# Altium schematic sheet [26] - BLE, WIFI.SchDoc (part 2 of 2)
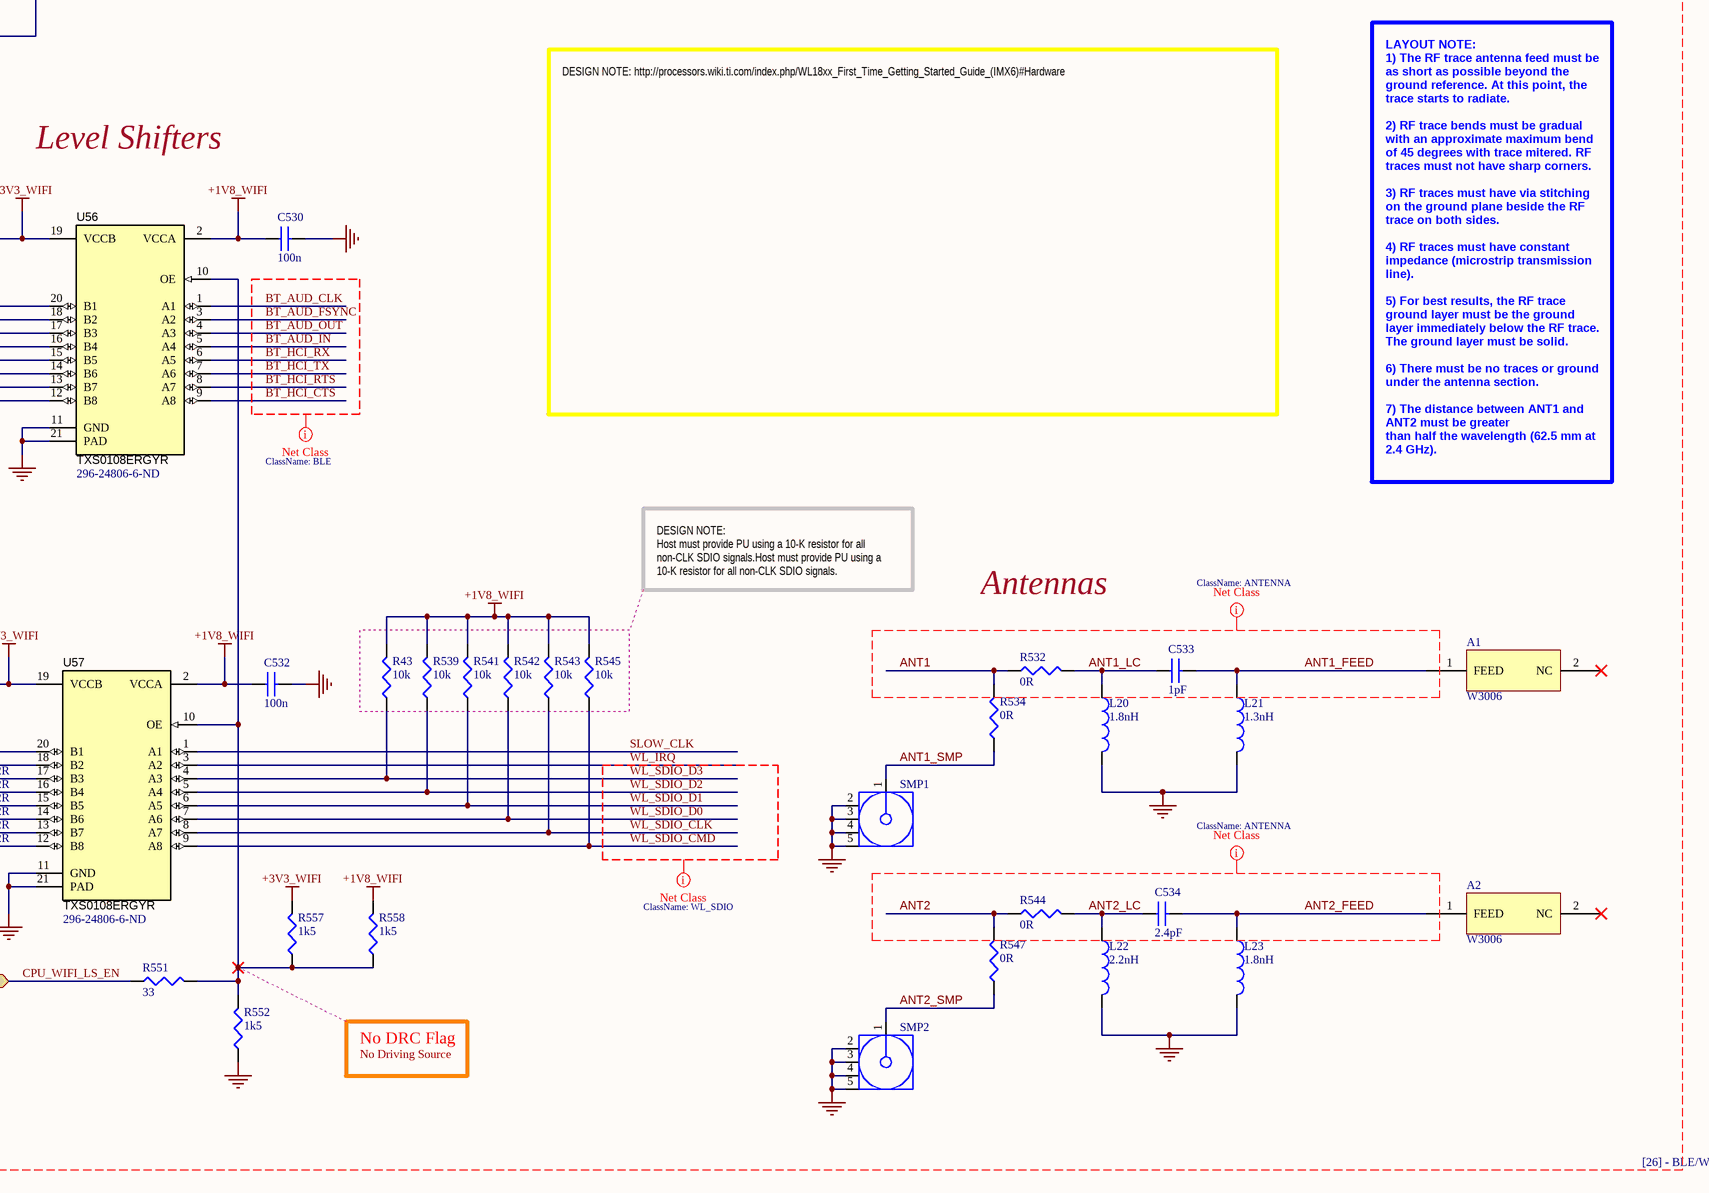
[diagram p4: [26] - BLE, WIFI.SchDoc, bottom right]

## Library data of the parts
A1 A2 = W3006: ANTENNA WLAN DUALBAND CERAM CHIP; Manufacturer: Pulse Electronics; Impedance: 50R; Frequency: 5GHz; Number of Bands: 2; Return Loss: -10dB; Max Frequency: 5.85GHz; .Creator: MB; Supplier 1: Digi-Key; Manufacturer Part Number: W3006; Stock 1: 500; Pricing 1: 1=2.04, 10=1.846, 25=1.648, 100=1.4832, 250=1.3184, 500=1.1536 (USD); Mount: Surface Mount; Case/Package: SMD/SMT; Number of Pins: 2; Contact Plating: Tin,Matte; Min Operating Temperature: -40°C; Max Operating Temperature: 85°C; Termination: Solder; Packaging: Bulk; Package Quantity: 1; Length: 10mm; Height: 0.059inch; Width: 3.2mm; Radiation Hardening: No; ComponentLink1URL: https://datasheet.ciiva.com/2792/+w3006-2792242.pdf; ComponentLink1Description: https://datasheet.ciiva.com/2792/+w3006-2792242.pdf; ComponentLink2URL: https://datasheet.ciiva.com/2792/+w3006-2792243.pdf; ComponentLink2Description: https://datasheet.ciiva.com/2792/+w3006-2792243.pdf; ComponentLink3URL: https://datasheet.ciiva.com/2792/+w3006-2792244.pdf; ComponentLink3Description: https://datasheet.ciiva.com/2792/+w3006-2792244.pdf; ComponentLink4URL: https://datasheet.ciiva.com/4432/w3006-203400-4432372.pdf; ComponentLink4Description: https://datasheet.ciiva.com/4432/w3006-203400-4432372.pdf; ComponentLink5URL: https://datasheet.ciiva.com/8152/antennas-g00302-8152982.pdf; ComponentLink5Description: https://datasheet.ciiva.com/8152/antennas-g00302-8152982.pdf; Supplier Part Number 1: 553-1673-1-ND; .Checked SCH: *; .Checked PCB: *
C522 = C0603X5R1C104K030BC: CAP CER 0.1UF 16V 10% X5R 0201; Manufacturer: TDK Corporation; Capacitance: 0.1µF; .Creator: MM; .Checked PCB: used; Supplier 1: Digi-Key; Manufacturer Part Number: C0603X5R1C104K030BC; RoHS: RoHS Compliant; Category: Capacitors; Stock 1: 19491; Pricing 1: 1=0.1, 10=0.046, 100=0.0209, 250=0.01712, 500=0.01464, 1000=0.0114, 5000=0.0095 (USD); Packaging: Cut Tape (CT); Tolerance: ±10%; Voltage - Rated: 16V; Temperature Coefficient: X5R; Mounting Type: Surface Mount, MLCC; Operating Temperature: -55°C ~ 85°C; Applications: General Purpose; Ratings: -; Package / Case: 0201 (0603 Metric); Size / Dimension: 0.024" L x 0.012" W (0.60mm x 0.30mm); Height - Seated (Max): -; Thickness (Max): 0.013" (0.33mm); Lead Spacing: -; Features: -; Lead Style: -; ComponentLink1URL: http://product.tdk.com/en/catalog/datasheets/mlcc_commercial_general_en.pdf; ComponentLink1Description: http://product.tdk.com/en/catalog/datasheets/mlcc_commercial_general_en.pdf; Supplier Part Number 1: 445-7313-1-ND; .Checked SCH: used; Supplier 2: Digi-Key
C523-C525 = C1608X5R0J106M: CAP CER 10UF 6.3V X5R 20% 0603; Manufacturer: TDK Corporation; Capacitance: 10µF; Value: 10µF; .Checked PCB: used; Category: Capacitors; Supplier Part Number: 445-4112-1-ND; Manufacturer Part Number: C1608X5R0J106M; Operating Temperature: -55°C ~ 85°C; Package / Case: 0603 (1608 Metric); Price 1k [$]: 0.08580; .Checked SCH: used; Voltage - Rated: 6.3V; Features: Low ESR; Supplier: Digikey; Supplier 1: Digi-Key; Supplier Part Number 1: 445-4112-1-ND; RoHS: RoHS Compliant; Stock 1: 48157; Pricing 1: 1=0.46, 10=0.363, 100=0.1898, 250=0.14024, 500=0.1089, 1000=0.0858 (USD); Tolerance: ±20%; Temperature Coefficient: X5R; Mounting Type: Surface Mount, MLCC; Applications: General Purpose; Ratings: -; Size / Dimension: 0.063" L x 0.031" W (1.60mm x 0.80mm); Height - Seated (Max): -; Thickness (Max): 0.037" (0.95mm); Lead Spacing: -; Packaging: Cut Tape (CT); Lead Style: -; ComponentLink1URL: http://www.tdk.com/pdf/general_B11.pdf; ComponentLink1Description: http://www.tdk.com/pdf/general_B11.pdf
C526 = GRM0335C1H6R8BA01D: CAP CER 6.8pF 0201 50volts C0G +/-0.1pF; Manufacturer: Murata; Voltage Rating: 50V; .Creator: MB; Supplier 1: Digi-Key; Manufacturer Part Number: GRM0335C1H6R8BA01D; Stock 1: 29500; Pricing 1: 1=0.1, 10=0.021, 100=0.0092, 500=0.00656, 1000=0.00516, 2500=0.00469, 5000=0.00431 (USD); Mount: Surface Mount; Case/Package: 0201; Case Code (Imperial): 0201; Case Code (Metric): 0603; Min Operating Temperature: -55°C; Max Operating Temperature: 125°C; Capacitance: 6.8pF; Voltage Rating (DC): 50V; Packaging: Tape and Reel; Package Quantity: 15000; Dielectric: C0G; Termination: SMD/SMT; Length: 0.024inch; Height: 0.3mm; Width: 0.3mm; Thickness: 0.013inch; ComponentLink1URL: https://datasheet.ciiva.com/29538/partnumbering-e-01-29538455.pdf; ComponentLink1Description: https://datasheet.ciiva.com/29538/partnumbering-e-01-29538455.pdf; Supplier Part Number 1: 490-17817-1-ND; .Checked SCH: *; .Checked PCB: *
C527 = C1005X5R1C105K: CAP CER 1.0UF 16V X5R 0402; Manufacturer: TDK Corporation; Capacitance: 1.0µF; Value: 1uF; .Checked PCB: used; Tolerance: ±10%; Category: Capacitors; Supplier Part Number: 445-4978-1-ND; Manufacturer Part Number: C1005X5R1C105K; Operating Temperature: -55°C ~ 85°C; Package / Case: 0402 (1005 Metric); Price 1k [$]: 0.02080; .Checked SCH: used; Voltage - Rated: 16V; Supplier: Digikey; Supplier 1: Digi-Key; Supplier Part Number 1: 445-4978-1-ND; RoHS: RoHS Compliant; Stock 1: 341010; Pricing 1: 1=0.24, 10=0.16, 100=0.064, 250=0.046, 500=0.0328, 1000=0.024 (USD); Temperature Coefficient: X5R; Mounting Type: Surface Mount, MLCC; Applications: General Purpose; Ratings: -; Size / Dimension: 0.039" L x 0.020" W (1.00mm x 0.50mm); Height - Seated (Max): -; Thickness (Max): 0.022" (0.55mm); Lead Spacing: -; Features: -; Packaging: Cut Tape (CT); Lead Style: -; ComponentLink1URL: http://www.tdk.co.jp/tefe02/e412_c.pdf; ComponentLink1Description: http://www.tdk.co.jp/tefe02/e412_c.pdf; Supplier 2: Digi-Key; Supplier Part Number 2: 445-13181-1-ND
C528-C532 = C1005X5R1H104K: CAP CER .10UF 50V X5R 10% 0402; Manufacturer: TDK Corporation; Capacitance: 0.1µF; Value: 100nF; .Checked PCB: used; Category: Capacitors; Supplier Part Number: 445-5942-1-ND; Manufacturer Part Number: C1005X5R1H104K; Operating Temperature: -55°C ~ 85°C; Package / Case: 0402 (1005 Metric); Price 1k [$]: 0.02340; .Checked SCH: used; Voltage - Rated: 50V; Supplier: Digikey; Supplier 1: Digi-Key; Supplier Part Number 1: 445-5942-1-ND; RoHS: RoHS Compliant; Stock 1: 106926; Pricing 1: 1=0.27, 10=0.18, 100=0.072, 250=0.05176, 500=0.0369, 1000=0.027 (USD); Tolerance: ±10%; Temperature Coefficient: X5R; Mounting Type: Surface Mount, MLCC; Applications: General Purpose; Ratings: -; Size / Dimension: 0.039" L x 0.020" W (1.00mm x 0.50mm); Height - Seated (Max): -; Thickness (Max): 0.022" (0.55mm); Lead Spacing: -; Features: -; Packaging: Cut Tape (CT); Lead Style: -; ComponentLink1URL: http://www.tdk.co.jp/tefe02/e412_c.pdf; ComponentLink1Description: http://www.tdk.co.jp/tefe02/e412_c.pdf; Supplier 2: Digi-Key; Supplier Part Number 2: 311-1697-6-ND
C533 = GJM1555C1H1R0BB01D: CAP CER 1pF 50V C0G 0.1pF SMD 0402 125C T/R; Manufacturer: Murata; Temperature Coefficient: 30ppm/°C; .Creator: MB; Supplier 1: Digi-Key; Manufacturer Part Number: GJM1555C1H1R0BB01D; Stock 1: 8519; Pricing 1: 1=0.17, 10=0.122, 100=0.0572, 500=0.04012, 1000=0.03322, 2500=0.03092, 5000=0.02829 (USD); Mount: Surface Mount; Case/Package: 0402; Number of Pins: 2; Case Code (Metric): 1005; Case Code (Imperial): 0402; Min Operating Temperature: -55°C; Max Operating Temperature: 125°C; Capacitance: 1pF; Dielectric: C0G; Voltage Rating: 50V; Packaging: Tape and Reel; Package Quantity: 10000; Termination: SMD/SMT; Voltage Rating (DC): 50V; Voltage: 50V; Length: 1mm; Height: 0.5mm; Width: 0.02inch; Thickness: 0.022inch; Depth: 0.5mm; Lead Pitch: 0.3mm; Radiation Hardening: No; Lead Free: Lead Free; REACH SVHC: No SVHC; ComponentLink1URL: https://datasheet.ciiva.com/2989/product-2989251.pdf; ComponentLink1Description: https://datasheet.ciiva.com/2989/product-2989251.pdf; ComponentLink2URL: https://datasheet.ciiva.com/8030/1700185-8030099.pdf; ComponentLink2Description: https://datasheet.ciiva.com/8030/1700185-8030099.pdf; ComponentLink3URL: https://datasheet.ciiva.com/6270/partnumbering-e-01-6270536.pdf; ComponentLink3Description: https://datasheet.ciiva.com/6270/partnumbering-e-01-6270536.pdf; ComponentLink4URL: https://datasheet.ciiva.com/18183/getdatasheetpartid-153061-18183816.pdf; ComponentLink4Description: https://datasheet.ciiva.com/18183/getdatasheetpartid-153061-18183816.pdf; ComponentLink5URL: https://datasheet.ciiva.com/6270/partnumbering-e-01-6270537.pdf; ComponentLink5Description: https://datasheet.ciiva.com/6270/partnumbering-e-01-6270537.pdf; ComponentLink6URL: https://datasheet.ciiva.com/6270/partnumbering-e-01-6270538.pdf; ComponentLink6Description: https://datasheet.ciiva.com/6270/partnumbering-e-01-6270538.pdf; ComponentLink7URL: https://datasheet.ciiva.com/11789/0900766b80ef921d-11789098.pdf; ComponentLink7Description: https://datasheet.ciiva.com/11789/0900766b80ef921d-11789098.pdf; Supplier Part Number 1: 490-6073-1-ND; .Checked SCH: *; .Checked PCB: *
C534 = GJM1555C1H2R4BB01D: CAP CER 2.4pF 0402 50Volts C0G +/-0.1pF; Manufacturer: Murata; Voltage Rating: 50V; .Creator: MB; Supplier 1: Digi-Key; Manufacturer Part Number: GJM1555C1H2R4BB01D; Stock 1: 81966; Pricing 1: 1=0.19, 10=0.13, 100=0.0659, 500=0.04508, 1000=0.03987, 2500=0.03814, 5000=0.03467 (USD); Mount: Surface Mount; Case/Package: 0402; Case Code (Metric): 1005; Case Code (Imperial): 0402; Min Operating Temperature: -55°C; Max Operating Temperature: 125°C; Capacitance: 2.4pF; Dielectric: C0G; Packaging: Tape and Reel; Package Quantity: 1; Voltage Rating (DC): 50V; Termination: SMD/SMT; Voltage: 50V; Length: 1mm; Height: 0.5mm; Width: 0.02inch; Thickness: 0.022inch; Depth: 0.5mm; Radiation Hardening: No; Lead Free: Lead Free; ComponentLink1URL: https://datasheet.ciiva.com/29541/partnumbering-e-01-29541979.pdf; ComponentLink1Description: https://datasheet.ciiva.com/29541/partnumbering-e-01-29541979.pdf; ComponentLink2URL: https://datasheet.ciiva.com/29541/partnumbering-e-01-29541980.pdf; ComponentLink2Description: https://datasheet.ciiva.com/29541/partnumbering-e-01-29541980.pdf; ComponentLink3URL: https://datasheet.ciiva.com/29541/partnumbering-e-01-29541981.pdf; ComponentLink3Description: https://datasheet.ciiva.com/29541/partnumbering-e-01-29541981.pdf; Supplier Part Number 1: 490-8093-1-ND; .Checked SCH: *; .Checked PCB: *
D54 = LG L29K-G2J1-24-Z: LED SMARTLED GREEN 570NM 0603; Manufacturer: OSRAM Opto Semiconductors Inc; .Checked PCB: used; Current - Test: 2mA; Voltage - Forward (Vf) Typ: 1.7V; Luminous Flux @ Current - Test: 12 mlm; Millicandela Rating: 3.92mcd; Wavelength - Peak: 572nm; Lens Type: Diffused; Lens Style/Size: Rectangle with Flat Top, 1.3mm x 0.8mm; Viewing Angle: 160°; Regulator Topology: Positive Fixed; Voltage - Output: 2.5V; Voltage - Input: 2.6 V ~ 6 V; Voltage - Dropout (Typical): 0.16V @ 500mA; Number of Regulators: 1; Current - Output: 500mA; Current - Limit (Min): 600mA; .Checked SCH: used; Category: Optoelectronics; Family: LEDs - <75mA, Discre; Manufacturer Part Number: LG L29K-G2J1-24-Z; Price 1k [$]: 0.08744; Value: Green; Color: Green; Package / Case: 0603 (1608 Metric); Supplier Part Number: 475-2709-1-ND; Supplier: Digikey; Supplier 1: Digi-Key; Supplier Part Number 1: 475-2709-1-ND; RoHS: RoHS Compliant; Stock 1: 30318; Pricing 1: 1=0.16, 10=0.137, 100=0.1093, 250=0.09564, 500=0.08744 (USD); Wavelength - Dominant: 570nm; Size / Dimension: 1.70mm L x 0.80mm W; Height: 0.65mm; Mounting Type: Surface Mount; Packaging: Cut Tape (CT); ComponentLink1URL: http://catalog.osram-os.com/catalogue/catalogue.do;jsessionid=32CB61882C089EDD4B6D0A54E7E1F117?act=downloadFile&favOid=020000020000138e000100b6; ComponentLink1Description: http://catalog.osram-os.com/catalogue/catalogue.do;jsessionid=32CB61882C089EDD4B6D0A54E7E1F117?act=downloadFile&favOid=020000020000138e000100b6; Operating Temperature: -40°C ~ 125°C; Supplier Device Package: 6-TMLF® (1.6x1.6); ComponentLink2URL: http://www.micrel.com/_PDF/mic5353.pdf; ComponentLink2Description: http://www.micrel.com/_PDF/mic5353.pdf
D55 = LO L29K-H2K1-24-Z: LED SMARTLED ORANGE 606NM 0603; Manufacturer: OSRAM Opto Semiconductors Inc; Millicandela Rating: 6.3mcd; Voltage - Forward (Vf) Typ: 1.8V; Current - Test: 2mA; Wavelength - Peak: 610nm; Viewing Angle: 160°; Lens Type: Diffused; Lens Style/Size: Rectangle with Flat Top, 1.3mm x 0.8mm; Luminous Flux @ Current - Test: 25 mlm; .Checked PCB: used; Supplier 1: Digi-Key; Supplier Part Number 1: 475-2740-1-ND; Manufacturer Part Number: LO L29K-H2K1-24-Z; RoHS: RoHS Compliant; Category: Optoelectronics; Stock 1: 15900; Pricing 1: 1=0.17, 10=0.141, 100=0.1127, 250=0.0986, 500=0.09016 (USD); Color: Orange; Wavelength - Dominant: 606nm; Package / Case: 0603 (1608 Metric); Size / Dimension: 1.70mm L x 0.80mm W; Height: 0.65mm; Mounting Type: Surface Mount; Packaging: Cut Tape (CT); ComponentLink1URL: http://catalog.osram-os.com/catalogue/catalogue.do;jsessionid=302CF83AF637AE24E40AEB0ADA267EDD?act=downloadFile&favOid=020000010003f9de000100b6; ComponentLink1Description: http://catalog.osram-os.com/catalogue/catalogue.do;jsessionid=302CF83AF637AE24E40AEB0ADA267EDD?act=downloadFile&favOid=020000010003f9de000100b6; .Checked SCH: used
FB50 FB51 = MPZ1608S601A: FERRITE CHIP BEAD 600 OHM SMD 1A; Manufacturer: TDK Corporation; Impedance @ Frequency: 600 Ohm @ 100MHz; DC Resistance (DCR): 150 mOhm Max; Filter Type: Differential Mode - Single; Number of Lines: 1; .Checked PCB: used; Supplier 1: Digi-Key; Supplier Part Number 1: 445-2205-1-ND; Manufacturer Part Number: MPZ1608S601A; RoHS: RoHS Compliant; Category: Filters; Stock 1: 328345; Pricing 1: 1=0.36, 10=0.24, 100=0.096, 250=0.069, 500=0.0492, 1000=0.036 (USD); Current Rating: 1A; Package / Case: 0603 (1608 Metric); Mounting Type: Surface Mount; Packaging: Cut Tape (CT); Height (Max): 0.037" (0.95mm); Size / Dimension: 0.063" L x 0.031" W (1.60mm x 0.80mm); ComponentLink1URL: http://www.tdk.co.jp/tefe02/e9413_mpz.pdf; ComponentLink1Description: http://www.tdk.co.jp/tefe02/e9413_mpz.pdf; .Checked SCH: used
FB52 = BLM15PD121SN1D: FERRITE CHIP 120 OHM 1300MA 0402; Manufacturer: Murata Electronics North America; Impedance @ Frequency: 120 Ohm @ 100MHz; DC Resistance (DCR): 90 mOhm Max; Filter Type: Differential Mode - Single; .Checked PCB: used; .Creator: MM; Supplier 1: Digi-Key; Manufacturer Part Number: BLM15PD121SN1D; RoHS: RoHS Compliant; Category: Filters; Stock 1: 478960; Pricing 1: 1=0.12, 10=0.096, 50=0.0636, 100=0.0549, 250=0.04332, 500=0.03658, 1000=0.0308, 5000=0.02743 (USD); Packaging: Cut Tape (CT); Current Rating: 1.3A; Package / Case: 0402 (1005 Metric); Mounting Type: Surface Mount; Height (Max): 0.022" (0.55mm); Size / Dimension: 0.039" L x 0.020" W (1.00mm x 0.50mm); ComponentLink1URL: http://media.digikey.com/pdf/Data%20Sheets/Murata%20PDFs/BLM15P_Series.pdf; ComponentLink1Description: http://media.digikey.com/pdf/Data%20Sheets/Murata%20PDFs/BLM15P_Series.pdf; Supplier Part Number 1: 490-5203-1-ND; .Checked SCH: used
L19 = IHLP1616ABER2R2M11: FIXED IND 2.2UH 2.75A 83.5 MOHM; Manufacturer: Vishay Dale; Type: Molded; Inductance: 2.2µH; Tolerance: ±20%; Current - Saturation: 3A; Shielding: Shielded; DC Resistance (DCR): 83.5 mOhm Max; Frequency - Self Resonant: 49MHz; Frequency - Test: 100kHz; .Creator: MM; .Checked PCB: used; Supplier 1: Digi-Key; Manufacturer Part Number: IHLP1616ABER2R2M11; RoHS: RoHS Compliant; Category: Inductors, Coils, Chokes; Stock 1: 11070; Pricing 1: 1=2.63, 10=2.45, 100=1.82, 500=1.54, 1000=1.435 (USD); Packaging: Cut Tape (CT); Material - Core: -; Current Rating: 2.75A; Q @ Freq: -; Operating Temperature: -55°C ~ 125°C; Mounting Type: Surface Mount; Package / Case: Nonstandard; Size / Dimension: 0.175" L x 0.160" W (4.45mm x 4.06mm); Height - Seated (Max): 0.047" (1.20mm); Supplier Device Package: -; ComponentLink1URL: http://media.digikey.com/pdf/Data%20Sheets/Vishay%20Dale%20PDFs/IHLP-1616-11.pdf; ComponentLink1Description: http://media.digikey.com/pdf/Data%20Sheets/Vishay%20Dale%20PDFs/IHLP-1616-11.pdf; Supplier Part Number 1: 541-1045-1-ND; .Checked SCH: used
L20 L23 = LQP15MN1N8B02D: FIXED IND 1.8nH 0.1nH 500MHz 13Q-Factor 280mA 200mOhm DCR 0402 T/R; Manufacturer: Murata; Core Material: Ferrite,Non-Magnetic; DC Resistance (DCR): 200mR; Q Factor: 13; Self Resonant Frequency: 6GHz; Shielding: Unshielded; .Creator: MB; Supplier 1: Digi-Key; Manufacturer Part Number: LQP15MN1N8B02D; Stock 1: 384280; Pricing 1: 1=0.19, 10=0.173, 100=0.1152, 500=0.09602, 1000=0.08066, 2500=0.06914 (USD); Mount: Surface Mount; Case/Package: 0402; Case Code (Metric): 1005; Case Code (Imperial): 0402; Min Operating Temperature: -40°C; Max Operating Temperature: 85°C; Inductance: 1.8nh; Max DC Current: 280mA; Packaging: Tape and Reel; Package Quantity: 10000; Current Rating: 280mA; Composition: Thin Film; Test Frequency: 500MHz; Termination: SMD/SMT; DC Current: 280mA; Military Standard: Not; Length: 1mm; Height: 0.35mm; Depth: 0.6mm; Width: 0.02inch; Height - Seated (Max): 0.018inch; Radiation Hardening: No; Lead Free: Lead Free; ComponentLink1URL: https://datasheet.ciiva.com/8510/l0075s0084lqp15m-8510296.pdf; ComponentLink1Description: https://datasheet.ciiva.com/8510/l0075s0084lqp15m-8510296.pdf; ComponentLink2URL: https://datasheet.ciiva.com/6690/l0075s0084lqp15m-6690778.pdf; ComponentLink2Description: https://datasheet.ciiva.com/6690/l0075s0084lqp15m-6690778.pdf; ComponentLink3URL: https://datasheet.ciiva.com/6690/l0075s0084lqp15m-6690779.pdf; ComponentLink3Description: https://datasheet.ciiva.com/6690/l0075s0084lqp15m-6690779.pdf; ComponentLink4URL: https://datasheet.ciiva.com/8510/l0075s0084lqp15m-8510299.pdf; ComponentLink4Description: https://datasheet.ciiva.com/8510/l0075s0084lqp15m-8510299.pdf; ComponentLink5URL: https://datasheet.ciiva.com/34302/1865111-34302907.pdf; ComponentLink5Description: https://datasheet.ciiva.com/34302/1865111-34302907.pdf; ComponentLink6URL: https://datasheet.ciiva.com/6690/l0075s0084lqp15m-6690780.pdf; ComponentLink6Description: https://datasheet.ciiva.com/6690/l0075s0084lqp15m-6690780.pdf; ComponentLink7URL: https://datasheet.ciiva.com/4978/product-4978349.pdf; ComponentLink7Description: https://datasheet.ciiva.com/4978/product-4978349.pdf; ComponentLink8URL: https://datasheet.ciiva.com/16207/l0075s0084lqp15m-16207886.pdf; ComponentLink8Description: https://datasheet.ciiva.com/16207/l0075s0084lqp15m-16207886.pdf; ComponentLink9URL: https://datasheet.ciiva.com/30490/0900766b81256025-30490302.pdf; ComponentLink9Description: https://datasheet.ciiva.com/30490/0900766b81256025-30490302.pdf; Supplier Part Number 1: 490-1127-1-ND; .Checked SCH: *; .Checked PCB: *
L21 = LQP15MN1N3B02D: FIXED IND 1.3nH 0402; Manufacturer: Murata; Core Material: Ferrite,Non-Magnetic; Current Rating: 280mA; DC Resistance (DCR): 200mR; Q Factor: 13; Shielding: Unshielded; Self Resonant Frequency: 6GHz; Current: 160mA; Test Frequency: 500MHz; .Creator: MB; Supplier 1: Digi-Key; Manufacturer Part Number: LQP15MN1N3B02D; Stock 1: 48866; Pricing 1: 1=0.19, 10=0.173, 100=0.1152, 500=0.09602, 1000=0.08066, 2500=0.06914 (USD); Mount: Surface Mount; Case/Package: 0402; Case Code (Metric): 1005; Case Code (Imperial): 0402; Min Operating Temperature: -55°C; Max Operating Temperature: 85°C; Inductance: 1.3nh; Max DC Current: 280mA; Packaging: Tape and Reel; Package Quantity: 10000; Termination: SMD/SMT; Composition: Thin Film; DC Current: 280mA; Military Standard: Not; Length: 1mm; Height: 0.35mm; Width: 0.5mm; Depth: 0.6mm; Height - Seated (Max): 0.018inch; Radiation Hardening: No; Lead Free: Lead Free; ComponentLink1URL: https://datasheet.ciiva.com/30490/0900766b81256025-30490358.pdf; ComponentLink1Description: https://datasheet.ciiva.com/30490/0900766b81256025-30490358.pdf; ComponentLink2URL: https://datasheet.ciiva.com/8507/l0075s0084lqp15m-8507161.pdf; ComponentLink2Description: https://datasheet.ciiva.com/8507/l0075s0084lqp15m-8507161.pdf; ComponentLink3URL: https://datasheet.ciiva.com/17277/l0075s0084lqp15m-17277929.pdf; ComponentLink3Description: https://datasheet.ciiva.com/17277/l0075s0084lqp15m-17277929.pdf; ComponentLink4URL: https://datasheet.ciiva.com/4978/product-4978619.pdf; ComponentLink4Description: https://datasheet.ciiva.com/4978/product-4978619.pdf; ComponentLink5URL: https://datasheet.ciiva.com/6705/l0075s0084lqp15m-6705196.pdf; ComponentLink5Description: https://datasheet.ciiva.com/6705/l0075s0084lqp15m-6705196.pdf; ComponentLink6URL: https://datasheet.ciiva.com/6705/l0075s0084lqp15m-6705198.pdf; ComponentLink6Description: https://datasheet.ciiva.com/6705/l0075s0084lqp15m-6705198.pdf; ComponentLink7URL: https://datasheet.ciiva.com/6705/l0075s0084lqp15m-6705199.pdf; ComponentLink7Description: https://datasheet.ciiva.com/6705/l0075s0084lqp15m-6705199.pdf; Supplier Part Number 1: 490-6748-1-ND; .Checked SCH: *; .Checked PCB: *
L22 = LQP15MN2N2B02D: FIXED IND 2.2NH 220MA 300 MOHM; Manufacturer: Murata; Core Material: Non-Magnetic; DC Resistance (DCR): 300mR; Shielding: Unshielded; Q Factor: 13; Self Resonant Frequency: 6GHz; Test Frequency: 500MHz; .Creator: MB; Supplier 1: Digi-Key; Manufacturer Part Number: LQP15MN2N2B02D; Stock 1: 9227; Pricing 1: 1=0.19, 10=0.173, 100=0.1152, 500=0.09602, 1000=0.08066, 2500=0.06914 (USD); Mount: Surface Mount; Case/Package: 0402; Case Code (Metric): 1005; Case Code (Imperial): 0402; Min Operating Temperature: -40°C; Max Operating Temperature: 85°C; Inductance: 2.2nh; Current Rating: 220mA; Max DC Current: 220mA; Packaging: Tape and Reel; Package Quantity: 10000; Composition: Thin Film; Termination: SMD/SMT; DC Current: 220mA; Military Standard: Not; Length: 1.1mm; Height: 0.35mm; Width: 0.02inch; Depth: 0.6mm; Height - Seated (Max): 0.018inch; Radiation Hardening: No; Lead Free: Lead Free; ComponentLink1URL: https://datasheet.ciiva.com/11801/0900766b80f155d9-11801394.pdf; ComponentLink1Description: https://datasheet.ciiva.com/11801/0900766b80f155d9-11801394.pdf; ComponentLink2URL: https://datasheet.ciiva.com/1039/l0075s0084lqp15m-1039846.pdf; ComponentLink2Description: https://datasheet.ciiva.com/1039/l0075s0084lqp15m-1039846.pdf; ComponentLink3URL: https://datasheet.ciiva.com/1039/l0075s0084lqp15m-1039847.pdf; ComponentLink3Description: https://datasheet.ciiva.com/1039/l0075s0084lqp15m-1039847.pdf; ComponentLink4URL: https://datasheet.ciiva.com/1039/l0075s0084lqp15m-1039848.pdf; ComponentLink4Description: https://datasheet.ciiva.com/1039/l0075s0084lqp15m-1039848.pdf; ComponentLink5URL: https://datasheet.ciiva.com/17277/l0075s0084lqp15m-17277946.pdf; ComponentLink5Description: https://datasheet.ciiva.com/17277/l0075s0084lqp15m-17277946.pdf; Supplier Part Number 1: 490-1128-1-ND; .Checked SCH: *; .Checked PCB: *
Q18 Q19 = 2N7002BKW,115: MOSFET N-CH 60V 310MA SOT323; Manufacturer: NXP Semiconductors; FET Type: MOSFET N-Channel, Metal Oxide; FET Feature: Logic Level Gate; Rds On (Max) @ Id, Vgs: 1.6 Ohm @ 500mA, 10V; Vgs(th) (Max) @ Id: 2.1V @ 250µA; Gate Charge (Qg) @ Vgs: 0.6nC @ 4.5V; Input Capacitance (Ciss) @ Vds: 50pF @ 10V; Power - Max: 275mW; .Checked PCB: used; Supplier 1: Digi-Key; Supplier Part Number 1: 1727-4788-1-ND; Manufacturer Part Number: 2N7002BKW,115; RoHS: RoHS Compliant; Category: Discrete Semiconductor Products; Drain to Source Voltage (Vdss): 60V; Current - Continuous Drain (Id) @ 25° C: 310mA; Mounting Type: Surface Mount; Package / Case: SC-70, SOT-323; Supplier Device Package: SC-70; Packaging: Cut Tape (CT); ComponentLink1URL: http://www.nxp.com/documents/data_sheet/2N7002BKW.pdf; ComponentLink1Description: http://www.nxp.com/documents/data_sheet/2N7002BKW.pdf; .Checked SCH: used
R43 R539 R541-R543 R545 = RC0201FR-0710KL: RES 10K OHM 1/20W 1% 0201 SMD; Manufacturer: Yageo; Power (Watts): 0.05W, 1/20W; Temperature Coefficient: ±200ppm/°C; .Creator: MM; .Checked PCB: used; Supplier 1: Digi-Key; Manufacturer Part Number: RC0201FR-0710KL; RoHS: RoHS Compliant; Category: Resistors; Stock 1: 529049; Pricing 1: 1=0.1, 10=0.074, 25=0.054, 100=0.0303, 250=0.02312, 500=0.0185, 1000=0.01361, 2500=0.01182, 5000=0.00976 (USD); Packaging: Cut Tape (CT); Resistance (Ohms): 10k; Tolerance: ±1%; Composition: Thick Film; Features: Moisture Resistant; Package / Case: 0201 (0603 Metric); Supplier Device Package: 0201; Size / Dimension: 0.024" L x 0.012" W (0.60mm x 0.30mm); Height: 0.010" (0.26mm); Number of Terminations: 2; ComponentLink1URL: http://www.yageo.com/documents/recent/PYu-RC0201_51_RoHS_L_8.pdf; ComponentLink1Description: http://www.yageo.com/documents/recent/PYu-RC0201_51_RoHS_L_8.pdf; Supplier Part Number 1: 311-10.0KMCT-ND; .Checked SCH: used; Supplier 2: Digi-Key; Supplier Part Number 2: 541-10.0KABCT-ND
R83 R525 R532 R534 R544 R547 R562-R573 R623 R624 R675 R676 = RC0402JR-070RL: RES 0.0 OHM 1/16W 0402 SMD; Manufacturer: Yageo; Resistance (Ohms): 0.0; Power (Watts): 0.063W, 1/16W; Tolerance: Jumper; .Checked PCB: used; Category: Resistors; Supplier Part Number: 311-0.0JRCT-ND; Manufacturer Part Number: RC0402JR-070RL; Package / Case: 0402 (1005 Metric); Price 1k [$]: 0.01389; Value: 0R; .Checked SCH: used; Supplier: Digikey; Supplier 1: Digi-Key; Supplier Part Number 1: 311-0.0JRCT-ND; RoHS: RoHS Compliant; Stock 1: 1106330; Pricing 1: 10=0.012, 50=0.009, 100=0.0069, 250=0.00512, 500=0.0038, 1000=0.00253 (USD); Composition: Thick Film; Features: -; Temperature Coefficient: -; Size / Dimension: 0.039" L x 0.020" W (1.00mm x 0.50mm); Height: 0.016" (0.40mm); Number of Terminations: 2; Packaging: Cut Tape (CT); ComponentLink1URL: http://www.yageo.com/documents/recent/PYu-RC0402_51_RoHS_L_6.pdf; ComponentLink1Description: http://www.yageo.com/documents/recent/PYu-RC0402_51_RoHS_L_6.pdf
R220 R512-R515 R517-R521 R523 R526-R531 R533 R535-R538 R540 R546 R548 R584-R586 R627 R628 = RC0402FR-0722RL: RES 22.0 OHM 1/16W 1% 0402 SMD; Manufacturer: Yageo; Resistance (Ohms): 22; Power (Watts): 0.063W, 1/16W; .Checked PCB: used; Temperature Coefficient: ±100ppm/°C; Category: Resistors; Supplier Part Number: 311-22.0LRCT-ND; Manufacturer Part Number: RC0402FR-0722RL; Package / Case: 0402 (1005 Metric); Price 1k [$]: 0.01421; Tolerance: ±1%; Value: 22R; .Checked SCH: used; Supplier: Digikey; Supplier 1: Digi-Key; Supplier Part Number 1: 311-22.0LRCT-ND; RoHS: RoHS Compliant; Stock 1: 943800; Pricing 1: 10=0.014, 50=0.0104, 100=0.0079, 250=0.00584, 500=0.00432, 1000=0.00288 (USD); Composition: Thick Film; Features: -; Size / Dimension: 0.039" L x 0.020" W (1.00mm x 0.50mm); Height: 0.016" (0.40mm); Number of Terminations: 2; Packaging: Cut Tape (CT); ComponentLink1URL: http://www.yageo.com/documents/recent/PYu-RC0402_51_RoHS_L_6.pdf; ComponentLink1Description: http://www.yageo.com/documents/recent/PYu-RC0402_51_RoHS_L_6.pdf
R507 = RC0805JR-070RL_small: RES 0.0 OHM 1/8W 0805 SMD; Manufacturer: Yageo; Resistance (Ohms): 0.0; Power (Watts): 0.125W, 1/8W; Tolerance: Jumper; .Checked PCB: used; .Creator: MM; Category: Resistors; Supplier Part Number: 311-0.0ARCT-ND; Manufacturer Part Number: RC0805JR-070RL; Package / Case: 0805 (2012 Metric); Price 1k [$]: 0.01479; Value: 0R; .Checked SCH: used; Supplier: Digikey; Supplier 1: Digi-Key; Supplier Part Number 1: 311-0.0ARCT-ND; RoHS: RoHS Compliant; Stock 1: 933202; Pricing 1: 10=0.017, 50=0.0126, 100=0.0096, 250=0.00716, 500=0.00528, 1000=0.00352 (USD); Composition: Thick Film; Features: -; Temperature Coefficient: -; Size / Dimension: 0.079" L x 0.049" W (2.00mm x 1.25mm); Height: 0.024" (0.60mm); Number of Terminations: 2; Packaging: Cut Tape (CT); ComponentLink1URL: http://www.yageo.com/documents/recent/PYu-RC0805_51_RoHS_L_4.pdf; ComponentLink1Description: http://www.yageo.com/documents/recent/PYu-RC0805_51_RoHS_L_4.pdf
R508 R510 R511 R549 R550 R553-R556 = RMCF0402FT100K: RES 100K OHM 1/16W 1% 0402 SMD; Manufacturer: Stackpole Electronics Inc; Power (Watts): 0.063W, 1/16W; .Checked PCB: used; Temperature Coefficient: ±100ppm/°C; Category: Resistors; Supplier Part Number: RMCF0402FT100KCT-ND; Manufacturer Part Number: RMCF0402FT100K; Package / Case: 0402 (1005 Metric); Price 1k [$]: 0.00384; Resistance (Ohms): 100K; Tolerance: ±1%; Value: 100k; .Checked SCH: used; Supplier: Digikey; Supplier 1: Digi-Key; Supplier Part Number 1: YAG1343DKR-ND; RoHS: RoHS Compliant; Composition: Thick Film; Features: -; Size / Dimension: 0.039" L x 0.020" W (1.00mm x 0.50mm); Height: 0.016" (0.40mm); Number of Terminations: 2; Packaging: Cut Tape (CT); ComponentLink1URL: http://www.seielect.com/Catalog/SEI-RMCF.pdf; ComponentLink1Description: http://www.seielect.com/Catalog/SEI-RMCF.pdf
R509 = RC0402FR-07200KL: RES 200K OHM 1% 1/16W 0402; Manufacturer: Yageo; Resistance: 200kR; Power Rating: 62.5mW; Voltage Rating: 50V; Max Power Dissipation: 63mW; Temperature Coefficient: 100ppm/°C; Supplier 1: Digi-Key; Manufacturer Part Number: RC0402FR-07200KL; Stock 1: 22026; Pricing 1: 1=0.1, 10=0.014, 100=0.0056, 1000=0.00253, 2500=0.0022, 5000=0.00181 (USD); Case/Package: 0402; Case Code (Metric): 1005; Case Code (Imperial): 0402; Min Operating Temperature: -55°C; Max Operating Temperature: 155°C; Tolerance: 1%; Package Quantity: 1; Packaging: Tape and Reel; Composition: Thick Film; Number of Terminations: 2; Termination: SMD/SMT; Military Standard: Not; Voltage Rating (DC): 50V; Working Voltage: 50V; Length: 1mm; Height: 0.016inch; Width: 0.02inch; Depth: 0.5mm; REACH SVHC: No SVHC; Lead Free: Lead Free; ComponentLink1URL: https://datasheet.ciiva.com/2453/pyu-r-int-thick-7-2453556.pdf; ComponentLink1Description: https://datasheet.ciiva.com/2453/pyu-r-int-thick-7-2453556.pdf; ComponentLink2URL: https://datasheet.ciiva.com/2453/pyu-r-int-thick-7-2453557.pdf; ComponentLink2Description: https://datasheet.ciiva.com/2453/pyu-r-int-thick-7-2453557.pdf; ComponentLink3URL: https://datasheet.ciiva.com/15189/getdatasheetpartid-323720-15189381.pdf; ComponentLink3Description: https://datasheet.ciiva.com/15189/getdatasheetpartid-323720-15189381.pdf; ComponentLink4URL: https://datasheet.ciiva.com/2453/pyu-r-int-thick-7-2453558.pdf; ComponentLink4Description: https://datasheet.ciiva.com/2453/pyu-r-int-thick-7-2453558.pdf; ComponentLink5URL: https://datasheet.ciiva.com/12667/pyu-rc0402-51-rohs-l-6-r-12667911.pdf; ComponentLink5Description: https://datasheet.ciiva.com/12667/pyu-rc0402-51-rohs-l-6-r-12667911.pdf; ComponentLink6URL: https://datasheet.ciiva.com/7849/1018594-7849896.pdf; ComponentLink6Description: https://datasheet.ciiva.com/7849/1018594-7849896.pdf; ComponentLink7URL: https://datasheet.ciiva.com/7849/1018594-7849897.pdf; ComponentLink7Description: https://datasheet.ciiva.com/7849/1018594-7849897.pdf; ComponentLink8URL: https://datasheet.ciiva.com/46394/1018594-46394953.pdf; ComponentLink8Description: https://datasheet.ciiva.com/46394/1018594-46394953.pdf; ComponentLink9URL: https://datasheet.ciiva.com/16740/pyu-rc0402-51-rohs-l-6-r-16740636.pdf; ComponentLink9Description: https://datasheet.ciiva.com/16740/pyu-rc0402-51-rohs-l-6-r-16740636.pdf; .Checked SCH: *; .Checked PCB: *; .Creator: *; Supplier Part Number 1: 311-200KLRCT-ND
R516 R522 = RMCF0402FT240R: RES TF 240 OHM 1% 0.0625W 0402; Manufacturer: Stackpole Electronics Inc; Resistance (Ohms): 240; Power (Watts): 0.063W, 1/16W; .Checked PCB: used; Temperature Coefficient: ±100ppm/°C; Category: Resistors; Supplier Part Number: RMCF0402FT240RCT-ND; Manufacturer Part Number: RMCF0402FT240R; Package / Case: 0402 (1005 Metric); Price 1k [$]: 0.00384; Tolerance: ±1%; Value: 240R; .Checked SCH: used; Supplier: Digikey; Supplier 1: Digi-Key; Supplier Part Number 1: RMCF0402FT240RCT-ND; RoHS: RoHS Compliant; Stock 1: 39860; Pricing 1: 1=0.04, 10=0.025, 50=0.0138, 100=0.0105, 250=0.0078, 500=0.00576, 1000=0.00384 (USD); Composition: Thick Film; Features: -; Size / Dimension: 0.039" L x 0.020" W (1.00mm x 0.50mm); Height: 0.016" (0.40mm); Number of Terminations: 2; Packaging: Cut Tape (CT); ComponentLink1URL: http://www.seielect.com/Catalog/SEI-RMCF.pdf; ComponentLink1Description: http://www.seielect.com/Catalog/SEI-RMCF.pdf
R524 = RC0402FR-0710KL: RES 10.0K OHM 1/16W 1% 0402 SMD; Manufacturer: Yageo; Power (Watts): 0.063W, 1/16W; .Checked PCB: used; Temperature Coefficient: ±100ppm/°C; Category: Resistors; Supplier Part Number: 311-10.0KLRCT-ND; Manufacturer Part Number: RC0402FR-0710KL; Package / Case: 0402 (1005 Metric); Price 1k [$]: 0.01421; Resistance (Ohms): 10K; Tolerance: ±1%; Value: 10k; .Checked SCH: used; Supplier: Digikey; Supplier 1: Digi-Key; Supplier Part Number 1: 311-10.0KLRCT-ND; RoHS: RoHS Compliant; Stock 1: 2916495; Pricing 1: 10=0.014, 50=0.0104, 100=0.0079, 250=0.00584, 500=0.00432, 1000=0.00288 (USD); Composition: Thick Film; Features: -; Size / Dimension: 0.039" L x 0.020" W (1.00mm x 0.50mm); Height: 0.016" (0.40mm); Number of Terminations: 2; Packaging: Cut Tape (CT); ComponentLink1URL: http://www.yageo.com/documents/recent/PYu-RC0402_51_RoHS_L_6.pdf; ComponentLink1Description: http://www.yageo.com/documents/recent/PYu-RC0402_51_RoHS_L_6.pdf
R551 = RC0201FR-0733RL: RES 33 OHM 1% 1/20W 0201; Manufacturer: Yageo; Power Rating: 50mW; Voltage Rating: 25V; Temperature Coefficient: 200ppm/°C; .Creator: MB; Supplier 1: Mouser; Manufacturer Part Number: RC0201FR-0733RL; Stock 1: 17957; Pricing 1: 1=0.1, 10=0.057, 50=0.057, 100=0.024, 1000=0.011, 10000=0.007 (USD); Case/Package: 0201; Case Code (Metric): 0603; Case Code (Imperial): 0201; Min Operating Temperature: -55°C; Max Operating Temperature: 125°C; Resistance: 33; Tolerance: 1%; Package Quantity: 1; Packaging: Tape and Reel; Composition: Thick Film; Number of Terminations: 2; Termination: SMD/SMT; Max Power Dissipation: 50mW; Length: 0.024inch; Height: 0.01inch; Width: 0.012inch; REACH SVHC: Unknown; Lead Free: Lead Free; ComponentLink1URL: https://datasheet.ciiva.com/22698/1563626-22698520.pdf; ComponentLink1Description: https://datasheet.ciiva.com/22698/1563626-22698520.pdf; ComponentLink2URL: https://datasheet.ciiva.com/2560/pyu-r-int-thick-7-2560877.pdf; ComponentLink2Description: https://datasheet.ciiva.com/2560/pyu-r-int-thick-7-2560877.pdf; ComponentLink3URL: https://datasheet.ciiva.com/2560/pyu-r-int-thick-7-2560878.pdf; ComponentLink3Description: https://datasheet.ciiva.com/2560/pyu-r-int-thick-7-2560878.pdf; ComponentLink4URL: https://datasheet.ciiva.com/2560/pyu-r-int-thick-7-2560879.pdf; ComponentLink4Description: https://datasheet.ciiva.com/2560/pyu-r-int-thick-7-2560879.pdf; ComponentLink5URL: https://datasheet.ciiva.com/7672/1563626-7672223.pdf; ComponentLink5Description: https://datasheet.ciiva.com/7672/1563626-7672223.pdf; Supplier Part Number 1: 603-RC0201FR-0733RL; .Checked SCH: *; .Checked PCB: *
R552 R557 R558 = RC0402FR-071K5L: RES 1.50K OHM 1/16W 1% 0402 SMD; Manufacturer: Yageo; Resistance (Ohms): 1.5k; Power (Watts): 0.063W, 1/16W; Temperature Coefficient: ±100ppm/°C; .Creator: MM; .Checked PCB: used; Supplier 1: Digi-Key; Manufacturer Part Number: RC0402FR-071K5L; RoHS: RoHS Compliant; Category: Resistors; Stock 1: 499348; Pricing 1: 1=0.1, 10=0.014, 25=0.0104, 100=0.0063, 250=0.0054, 500=0.00382, 1000=0.0027, 2500=0.00234, 5000=0.00203 (USD); Packaging: Cut Tape (CT); Tolerance: ±1%; Composition: Thick Film; Features: -; Package / Case: 0402 (1005 Metric); Supplier Device Package: 0402; Size / Dimension: 0.039" L x 0.020" W (1.00mm x 0.50mm); Height: 0.016" (0.40mm); Number of Terminations: 2; ComponentLink1URL: http://www.yageo.com/documents/recent/PYu-RC0402_51_RoHS_L_6.pdf; ComponentLink1Description: http://www.yageo.com/documents/recent/PYu-RC0402_51_RoHS_L_6.pdf; Supplier Part Number 1: 311-1.50KLRCT-ND; .Checked SCH: used
SMP1 SMP2 = SMP-F: CONN SMP PLUG STR 50 OHM SMD; Manufacturer: Molex, LLC; Part Number: 0734153320; Impedance: 50 Ohm; Frequency - Max: 40GHz; Fastening Type: Snap-On; Operating Temperature: -65°C ~ 155°C
TP57-TP60 = TP_25MILC: Test Point 25mil; .Checked PCB: used
U54 = TLV62568DRLR: 1-A High Efficiency Step-Down Converter in SOT Package, DRL0006A (SOT-OTHER-6); Alternate PartNumber: TLV62568DRLT; Manufacturer: Texas Instruments; Manufacturer Part Number: RC0201FR-07200KL; SymbolCreator: a0411947; SizeArea_mm2: 2.56; SizeAreaWB_mm2: 6.76; SizeX_mm: 1.6; SizeZ_mm: 0.6; CompType: IC; U/M: EA; Resistance: 200kR; Tolerance: 1%; Power Rating: 50mW; Voltage Rating: 25V; Temperature Coefficient: 200ppm/°C; SymbolVersion: 2016-08-27; PartNumber: TLV62568DRLR; PackageReference: DRL0006A; PackageDescription: SOT-OTHER-6; MountType: SMT; SizeY_mm: 1.6; ComponentLink1Description: Datasheet Link; ComponentLink1URL: http://www.ti.com/lit/ds/symlink/tlv62568.pdf; RoHS: Y; Publisher: Texas Instruments; LatestRevisionDate: 2017-05-22; Alternate Manufacturer: Texas Instruments; Case/Package: 0201; Case Code (Metric): 0603; Case Code (Imperial): 0201; Min Operating Temperature: -55°C; Max Operating Temperature: 125°C; Package Quantity: 10000; Packaging: Tape and Reel; Composition: Thick Film; Number of Terminations: 2; Termination: SMD/SMT; Max Power Dissipation: 50mW; Length: 0.024inch; Height: 0.01inch; Width: 0.012inch; Lead Free: Lead Free; ComponentLink2URL: https://datasheet.ciiva.com/14985/pyu-r-int-thick-7-14985445.pdf; ComponentLink2Description: https://datasheet.ciiva.com/14985/pyu-r-int-thick-7-14985445.pdf; Supplier 1: Digi-Key; Supplier Part Number 1: 296-48708-6-ND
U55 = WL1837MODGIMOCR: RF TXRX MOD BLUETOOTH/WIFI CHIP; Manufacturer: Texas Instruments; PartNumber: WL1837MODGIMOCR; RefDes: RefDes; TYPE: TYPE; Value: Value; ComponentLink1Description: Design Guide; ComponentLink1URL: http://www.ti.com/lit/ug/swru382a/swru382a.pdf; ComponentLink2Description: Data Sheet; ComponentLink2URL: http://www.ti.com/lit/ds/symlink/wl1837mod.pdf; Supplier 1: Digi-Key
U56 U57 = TXS0108ERGYR: 8-Bit Bidirectional Voltage-Level Shifter For Open-Drain And Push-Pull Application, RGY0020A (VQFN-20); Manufacturer: Texas Instruments; SymbolCreator: a0411947; SizeArea_mm2: 15.75; SizeAreaWB_mm2: 24.75; SizeX_mm: 3.5; SizeY_mm: 4.5; SizeZ_mm: 1; CompType: IC; U/M: EA; Green_Lifecycle: Active; Green_REACh: Passed; SymbolVersion: 2016-1-28; PartNumber: TXS0108ERGYR; PackageReference: RGY0020A; PackageDescription: VQFN-20; MountType: SMT; ComponentLink1Description: Datasheet Link; ComponentLink1URL: http://www.ti.com/lit/ds/symlink/txs0108e.pdf; RoHS: Y; Publisher: Texas Instruments; LatestRevisionDate: 2017-06-05; Alternate Manufacturer: Texas Instruments; Green_EU RoHS: Passed; Green_EU RoHS-2: Passed; Supplier 1: Digi-Key
Y7 = ASDK2-32.768KHZ-LR-T3: 32.768kHz CMOS XO (Standard) Oscillator Surface Mount 1.8V 1.5mA Enable/Disable; Manufacturer: Abracon; Frequency Stability: 25ppm; Supplier 1: Digi-Key; Manufacturer Part Number: ASDK2-32.768KHZ-LR-T3; Stock 1: 9547; Pricing 1: 1=1.39, 10=1.324, 50=1.2936, 100=1.1088, 500=1.078, 1000=0.9086 (USD); Mount: Surface Mount; Case/Package: SMD/SMT; Min Operating Temperature: -40°C; Max Operating Temperature: 85°C; Packaging: Cut Tape; Frequency: 32.768kHz; Max Supply Current: 1.5mA; Length: 0.098inch; Height: 0.037inch; Width: 0.079inch; Supplier Part Number 1: 535-13597-6-ND